# EAGLE design Truss-Power (EAGLE 9.2.2)
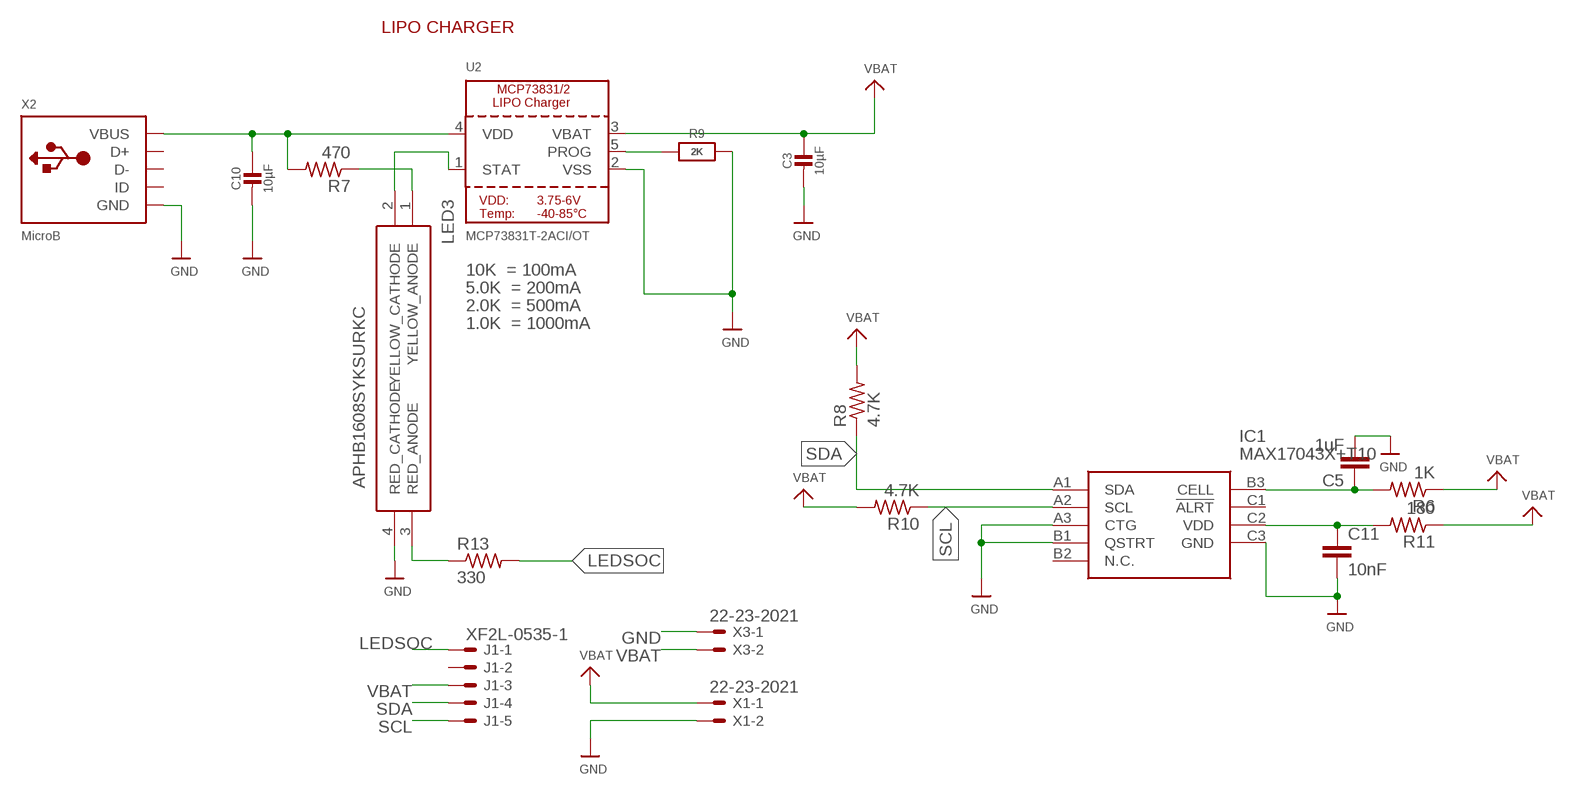
[diagram p0: schematic, sheet 1]

## Parts
C3  10µF  CAP_CERAMIC0805-NOOUTLINE  [0805-NO]
C5  1uF  C-EUC0603  [C0603]
C10  10µF  CAP_CERAMIC0805-NOOUTLINE  [0805-NO]
C11  10nF  C-EUC0603  [C0603]
IC1  MAX17043X+T10  [BGA9C40P3X3_160X142X69]
J1  XF2L-0535-1  [XF2L-0535-1]
LED3  APHB1608SYKSURKC  [APHB1608ZGSURKC]
R6  1K  R-US_R0402  [R0402]
R7  470  R-US_R0402  [R0402]
R8  4.7K  R-US_R0402  [R0402]
R9  2K  RESISTOR0805_NOOUTLINE  [0805-NO]
R10  4.7K  R-US_R0402  [R0402]
R11  180  R-US_R0402  [R0402]
R13  330  R-US_R0402  [R0402]
U2  MCP73831T-2ACI/OT  MCP73831/2  [SOT23-5]
X1  22-23-2021  [22-23-2021]
X2  MicroB  USBMICRO_20329  [4UCONN_20329]
X3  22-23-2021  [22-23-2021]

## Nets
GND: C3.2 C5.2 C10.2 C11.2 IC1.A3(CTG) IC1.B1(QSTRT) IC1.C3(GND) LED3.4(RED_CATHODE) R9.2 U2.2(VSS) X1.2 X2.BASE@1(GND) X2.BASE@2(GND) X2.GND X2.SPRT@1(GND) X2.SPRT@2(GND) X2.SPRT@3(GND) X2.SPRT@4(GND) X3.1
LEDSOC: J1.1 R13.2
N$1: C5.1 IC1.B3(CELL) R6.2
N$3: C11.1 IC1.C2(VDD) R11.2
N$4: LED3.1(YELLOW_ANODE) R7.1
N$5: LED3.2(YELLOW_CATHODE) U2.1(STAT)
N$6: LED3.3(RED_ANODE) R13.1
N$14: R9.1 U2.5(PROG)
SCL: IC1.A2(SCL) J1.5 R10.1
SDA: IC1.A1(SDA) J1.4 R8.1
VBAT: C3.1 J1.3 R6.1 R8.2 R10.2 R11.1 U2.3(VBAT) X1.1 X3.2
VBUS: C10.1 R7.2 U2.4(VDD) X2.VBUS
Unconnected: IC1.B2(N.C.) IC1.C1(!ALRT) J1.2 X2.D+ X2.D- X2.ID

## Notes on the sheet
- LIPO CHARGER
- 10K  = 100mA
- 5.0K  = 200mA
- 2.0K  = 500mA
- 1.0K  = 1000mA

## Library data of the parts
C3 C10 = microbuilder:CAP_CERAMIC: Ceramic Capacitors For new designs, use the packages preceded by an '_' character since they are more reliable: The following footprints should be used on most boards: _0402 - Standard footprint for regular board layouts _0603 - Standard footprint for regular board layouts _0805 - Standard footprint for regular board layouts _1206 - Standard footprint for regular board layouts For extremely tight-pitch boards where space is at a premium, the following 'micro-pitch' footprints can be used (smaller pads, no silkscreen outline, etc.): _0402MP - Micro-pitch footprint for very dense/compact boards _0603MP - Micro-pitch footprint for very dense/compact boards _0805MP - Micro-pitch footprint for very dense/compact boards _1206MP - Micro-pitch footprint for very dense/compact boards
C5 C11 = rcl:C-EU: CAPACITOR, European symbol
IC1 = SamacSys_Parts:MAX17043X+T10: IC FUEL GAUGE LI-ION 1CELL 9UCSP Source: Datasheet <https://componentsearchengine.com/Datasheets/1/MAX17043X T10.pdf>; DESCRIPTION: IC FUEL GAUGE LI-ION 1CELL 9UCSP; HEIGHT: 0.69mm; MANUFACTURER_NAME: Maxim Integrated; MANUFACTURER_PART_NUMBER: MAX17043X+T10; MOUSER_PART_NUMBER: 700-MAX17043X+T10; MOUSER_PRICE-STOCK: https://www.mouser.com/Search/Refine.aspx?Keyword=700-MAX17043X%2BT10
J1 = con-omron:XF2*-05?: OMRON FPC Connector Source : http://www.omron.com/ecb/products/pdf/fpc.pdf; MPN: XF2L-0535-1A; OC_FARNELL: unknown; OC_NEWARK: 37M0863
LED3 = APHB1608SYKSURKC:APHB1608SYKSURKC: LED RED/YLW CLEAR 0603 SMD Source: Datasheet <https://componentsearchengine.com/Datasheets/1/APHB1608SYKSURKC.pdf>; DESCRIPTION: LED RED/YLW CLEAR 0603 SMD; HEIGHT: 0mm; MANUFACTURER_NAME: Kingbright; MANUFACTURER_PART_NUMBER: APHB1608SYKSURKC; MOUSER_PART_NUMBER: 604-APHB1608SYKSURKC; MOUSER_PRICE-STOCK: https://www.mouser.com/Search/Refine.aspx?Keyword=604-APHB1608SYKSURKC
R6-R8 R10 R11 R13 = resistor:R-US_: RESISTOR, American symbol
R9 = microbuilder:RESISTOR: Resistors For new designs, use the packages preceded by an '_' character since they are more reliable: The following footprints should be used on most boards: _0402 - Standard footprint for regular board layouts _0603 - Standard footprint for regular board layouts _0805 - Standard footprint for regular board layouts _1206 - Standard footprint for regular board layouts For extremely tight-pitch boards where space is at a premium, the following 'micro-pitch' footprints can be used (smaller pads, no silkscreen outline, etc.): _0402MP - Micro-pitch footprint for very dense/compact boards _0603MP - Micro-pitch footprint for very dense/compact boards _0805MP - Micro-pitch footprint for very dense/compact boards _1206MP - Micro-pitch footprint for very dense/compact boards
U2 = microbuilder:MCP73831/2: MCP73831/2 LIPO Charger VDD: 3.75 - 6V Temp -40 - 85°C Programmable Charge Rate: 15-500mA NOTE: STAT is a tri-state logic output on the MCP73831 and an open-drain output on the MCP73832. SOT23-5 with 4.2V output and tri-state logic on STAT = MCP73831T-2ACI/OT
X1 X3 = con-molex:22-23-2021: .100" (2.54mm) Center Header - 2 Pin; MF: MOLEX; MPN: 22-23-2021; OC_FARNELL: 1462926; OC_NEWARK: 25C3832
X2 = microbuilder:USB: USB Connectors USBMINIB - Surface Mount Female Mini-B USB Connector 4UConnector: 06564

## Board
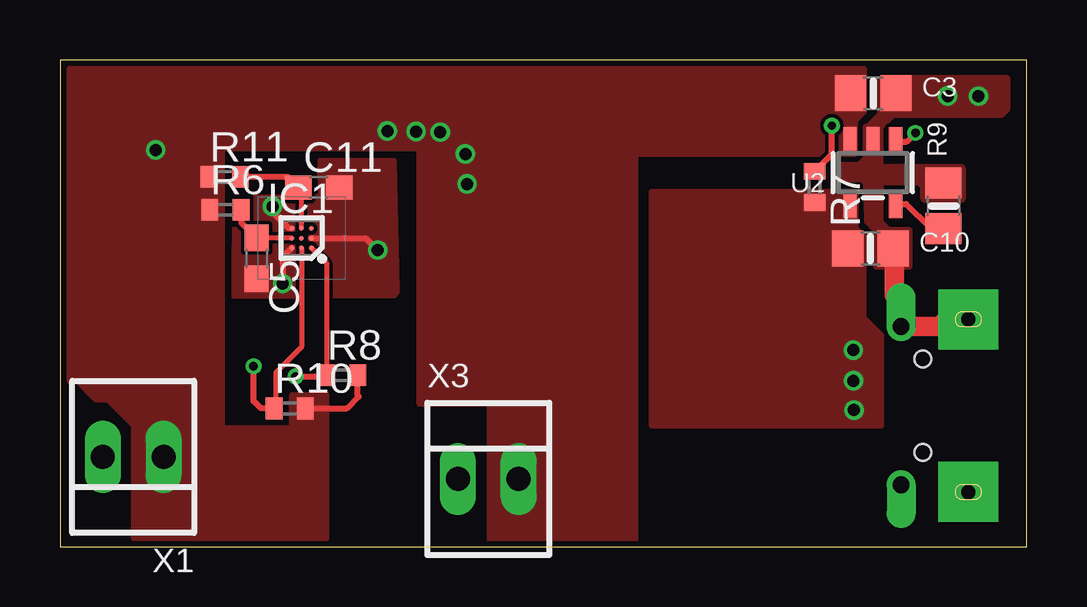
[diagram p1: board, top side]
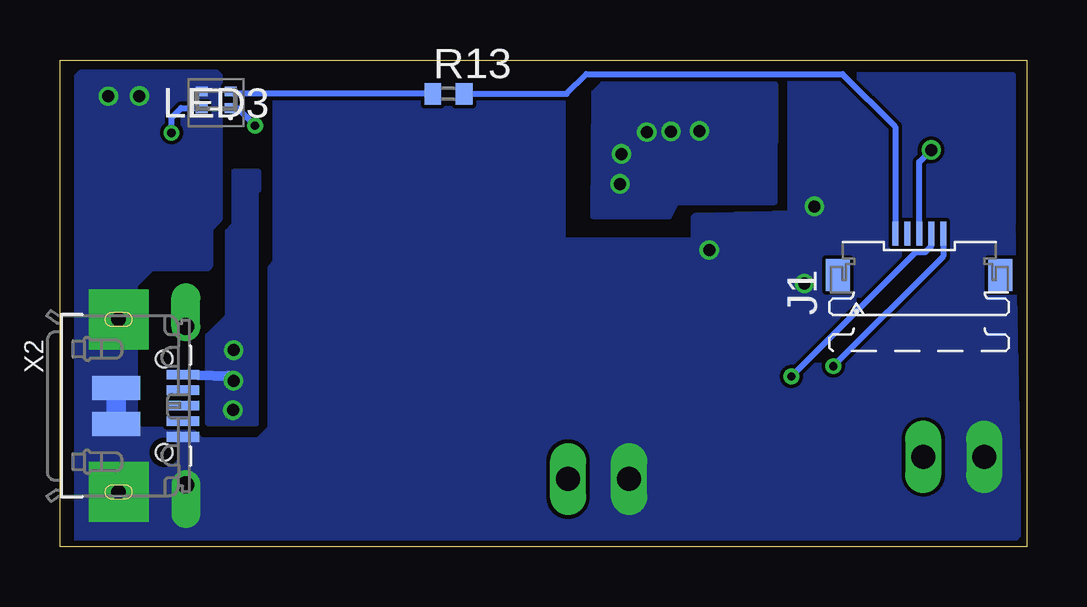
[diagram p2: board, bottom side, seen from below]

Size 40.31 x 20.31 mm. Coordinates in mm from the lower left corner, seen from the top.
Outline: 0,0 40.31,0 40.31,20.31 0,20.31 0,0
Copper layers (1*16): Top 0.035mm / dielectric 1.5mm / Bottom 0.035mm
Design rules "SeeedStudio_2layer_DRU_no_angle_20140221": minimum track width 6mil, minimum drill 12mil, track to track 6mil, track to pad 6mil, pad to pad 6mil, via to via 6mil, smd to smd 0mil, copper to edge 10mil, drill to drill 10mil, minimum pad ring 10mil, minimum via ring 6mil, stop-mask expansion 2mil, vias tented up to drill 100mil, thermal gap 10mil

### Footprints (pad centres in the part's own frame; a part is rotated, then mirrored left to right if it is on the bottom)
0805-NO = smd 1.3 x 1.5: 1 -0.95,0; 2 0.95,0
C0603 = smd 1.1 x 1: 1 -0.85,0; 2 0.85,0
BGA9C40P3X3_160X142X69 = smd 0.216 x 0.216: A1 -0.4,0.4; A2 0,0.4; A3 0.4,0.4; B1 -0.4,0; B2 0,0; B3 0.4,0; C1 -0.4,-0.4; C2 0,-0.4; C3 0.4,-0.4
XF2L-0535-1 = smd 1 x 0.25: 1 1.905,1; 2 1.905,0.5; 3 1.905,0; 4 1.905,-0.5; 5 1.905,-1 | smd 1.34 x 1: M1 0.18,3.388; M2 0.18,-3.388
APHB1608ZGSURKC = smd 0.5 x 0.4: 1 0.6,-0.35; 2 -0.6,-0.35; 3 0.6,0.35; 4 -0.6,0.35
R0402 = smd 0.7 x 0.9: 1 -0.65,0; 2 0.65,0
SOT23-5 = smd 0.55 x 1.2: 1 -0.95,-1.3; 2 0,-1.3; 3 0.95,-1.3; 4 0.95,1.3; 5 -0.95,1.3
22-23-2021 = drill 1 long: 1 -1.27,0; 2 1.27,0
4UCONN_20329 = smd 1 x 2: BASE@1 -0.75,-2; BASE@2 0.75,-2 | smd 0.4 x 1.35: D+ 0,0.775; D- -0.65,0.775; GND 1.3,0.775; ID 0.65,0.775; VBUS -1.3,0.775 | drill 0.7 offset: SPRT@1 -3.3,0.9; SPRT@2 3.3,0.9 | drill 0.6 pad 2.5 square: SPRT@3 -3.6,-1.9; SPRT@4 3.6,-1.9 | hole 0.7: -1.95,0; 1.95,0

### Placement (x,y rotation side)
C3  33.9,18.92 0 top
C5  8.19,12.04 270 top
C10  33.78,12.45 0 top
C11  10.79,14.99 0 top
IC1  10.07,12.88 180 top
J1  4.49,11.16 90 bottom
LED3  33.8,18.65 0 bottom
R6  6.9,14.06 0 top
R7  31.45,15.01 270 top
R8  11.77,7.16 0 top
R9  36.83,14.22 90 top
R10  9.58,5.78 0 top
R11  6.87,15.43 0 top
R13  24.12,18.9 0 bottom
U2  33.88,15.61 180 top
X1  3.05,3.76 180 top
X2  35.97,5.89 270 bottom
X3  17.85,2.83 0 top

### Tracks (layer width: path | path; a pad name or v marks a point on that pad's centre or on a via)
GND  (via drill 0.5)
  Top 0.254: v8.86,14.2 8.86,13.97 9.55,13.28 IC1.C3 | IC1.A3 9.28,12.09 v9.28,10.98 | IC1.B1 12.75,12.88 v13.24,12.38
  Top 0.813: C10.2 34.79,12.39 34.79,10.51 35.07,10.23 X2.SPRT@1 36.66,9.19 36.95,9.49 X2.SPRT@3
  Bottom 0.813: X2.BASE@1 X2.BASE@2
  other vias: 37,18.81 38.29,18.8
  pour Top (no thermals): 34.29,19.57 39.46,19.57 39.48,19.55 39.48,18.25 39.24,18.01 34.71,18.01 34.19,17.49 34.19,15.9 34.23,15.86 37.58,15.86 37.63,15.81 37.63,14.51 37.59,14.47 36.04,14.47 35.99,14.52 35.99,15 35.8,15.19 34.21,15.19 34.19,15.17 34.19,13.58 34.54,13.23 35.38,13.23 35.41,13.2 35.41,11.71 35.37,11.67 34.05,11.67 34.04,11.68 34.04,13.16 33.65,13.55 33.61,15.16 33.44,15.33 32.26,15.33 32.26,15.91 32.29,15.94 33.33,15.94 33.62,16.23 33.65,16.23 33.59,16.29 33.59,17.51 33.61,17.53 33.67,17.53 34.19,18.05 34.19,19.47
  pour Bottom (no thermals): 13.82,13.72 13.83,12.69 19.27,12.69 19.42,12.84 19.42,19.53 19.54,19.65 31.13,19.65 31.25,19.53 31.25,11.81 31.47,11.59 31.47,4.92 32.02,4.37 34.45,4.37 34.88,4.8 37.25,4.8 37.25,10.97 36.51,11.71 34.17,11.71 34.12,11.76 34.12,13.33 33.71,13.74 33.71,19.6 33.81,19.7 39.42,19.7 39.52,19.6 39.52,0.29 39.37,0.14 0.75,0.19 0.4,0.59 0.68,13.57 arc-90 0.65,13.6 0.65,19.63 arc90 0.69,19.59 9.76,19.59 arc-90 9.8,19.55 9.8,13.81
  pour Top (no thermals): 7.3,14.6 9.92,14.6 10.58,14.6 10.89,14.6 10.87,16.13 12.02,16.11 12.58,16.13 13.91,16.1 14.04,10.69 14.06,10.69 13.93,10.49 7.27,10.45
LEDSOC
  Bottom 0.254: R13.2 19.19,18.9 18.37,19.72 7.69,19.72 5.49,17.52 J1.1
N$1
  Top 0.203: IC1.B3 C5.1
  Top 0.254: C5.1 7.55,13.53 R6.2
N$3
  Top 0.203: IC1.C2 10.07,14.86
  Top 0.254: 10.07,14.86 C11.1 9.5,15.43 R11.2
N$4  (via drill 0.35)
  Top 0.254: R7.1 32.18,16.39 v32.18,17.57
  Bottom 0.254: v32.18,17.57 32.91,18.3 LED3.1
N$5  (via drill 0.35)
  Top 0.254: U2.1 35.3,16.91 v35.66,17.27
  Bottom 0.254: v35.66,17.27 35.66,17.9 35.26,18.3 LED3.2
N$6
  Bottom 0.254: R13.1 33.1,18.9 LED3.3
N$14
  Top 0.254: U2.5 35.27,14.31 36.26,13.32 36.78,13.32 R9.1
SCL  (via drill 0.35)
  Top 0.203: IC1.A2 10.07,8.34 8.99,7.26 8.99,5.84
  Top 0.254: 8.99,5.84 R10.1 8.38,5.78 8.07,6.09 v8.07,7.54
  Bottom 0.254: J1.5 3.49,12.12 v8.07,7.54
SDA  (via drill 0.35)
  Top 0.203: IC1.A1 11.11,11.84 R8.1
  Top 0.254: v9.82,7.11 11.06,7.11 R8.1
  Bottom 0.254: J1.4 3.99,12.55 4.25,12.29 4.64,12.29 v9.82,7.11
VBAT  (via drill 0.5)
  Top 0.254: R8.2 12.41,6.3 12.45,6.27 11.96,5.78 R10.2 10.23,5.53
  Bottom 0.254: J1.3 4.49,16.06 v3.99,16.56
  other vias: 13.65,17.35 14.84,17.33 15.85,17.3 16.97,15.14 16.9,16.39
  pour Bottom (no thermals): 10.49,19.28 17.7,19.28 18.05,18.93 18.1,13.81 18.01,13.79 14.91,13.79 14.62,14.36 14.59,14.39 12.39,14.38 10.51,14.39
  pour Top (no thermals): 9.68,6.35 11.1,6.35 11.1,0.35 3.09,0.35 3.09,5.05 2,6.14 1.49,6.14 0.71,6.92 0.41,6.92 0.41,19.95 33.51,19.95 33.51,18.15 33.13,17.77 33.13,16.38 23.96,16.38 23.96,0.25 17.92,0.25 17.92,5.96 14.99,5.96 14.99,16.61 6.73,16.61 6.73,4.97 9.68,4.97
VBUS  (via drill 0.5)
  Bottom 0.406: X2.VBUS 33.29,7.14 v33.08,6.93
  other vias: 33.07,8.21 33.1,5.71
  pour Bottom (no thermals): 32.03,15.64 33.05,15.64 33.05,13.42 33.33,13.14 33.33,9.62 34.15,8.8 34.15,5.17 32.13,5.17 32.13,14.89 32.03,14.89
  pour Top (no thermals): 34.23,5.05 24.67,5.05 24.67,14.82 33.16,14.82 33.16,13.29 33.49,12.96 33.49,9.57 34.22,8.84 34.22,5.06